# Altium project PowerManagment_V2.PrjPcb
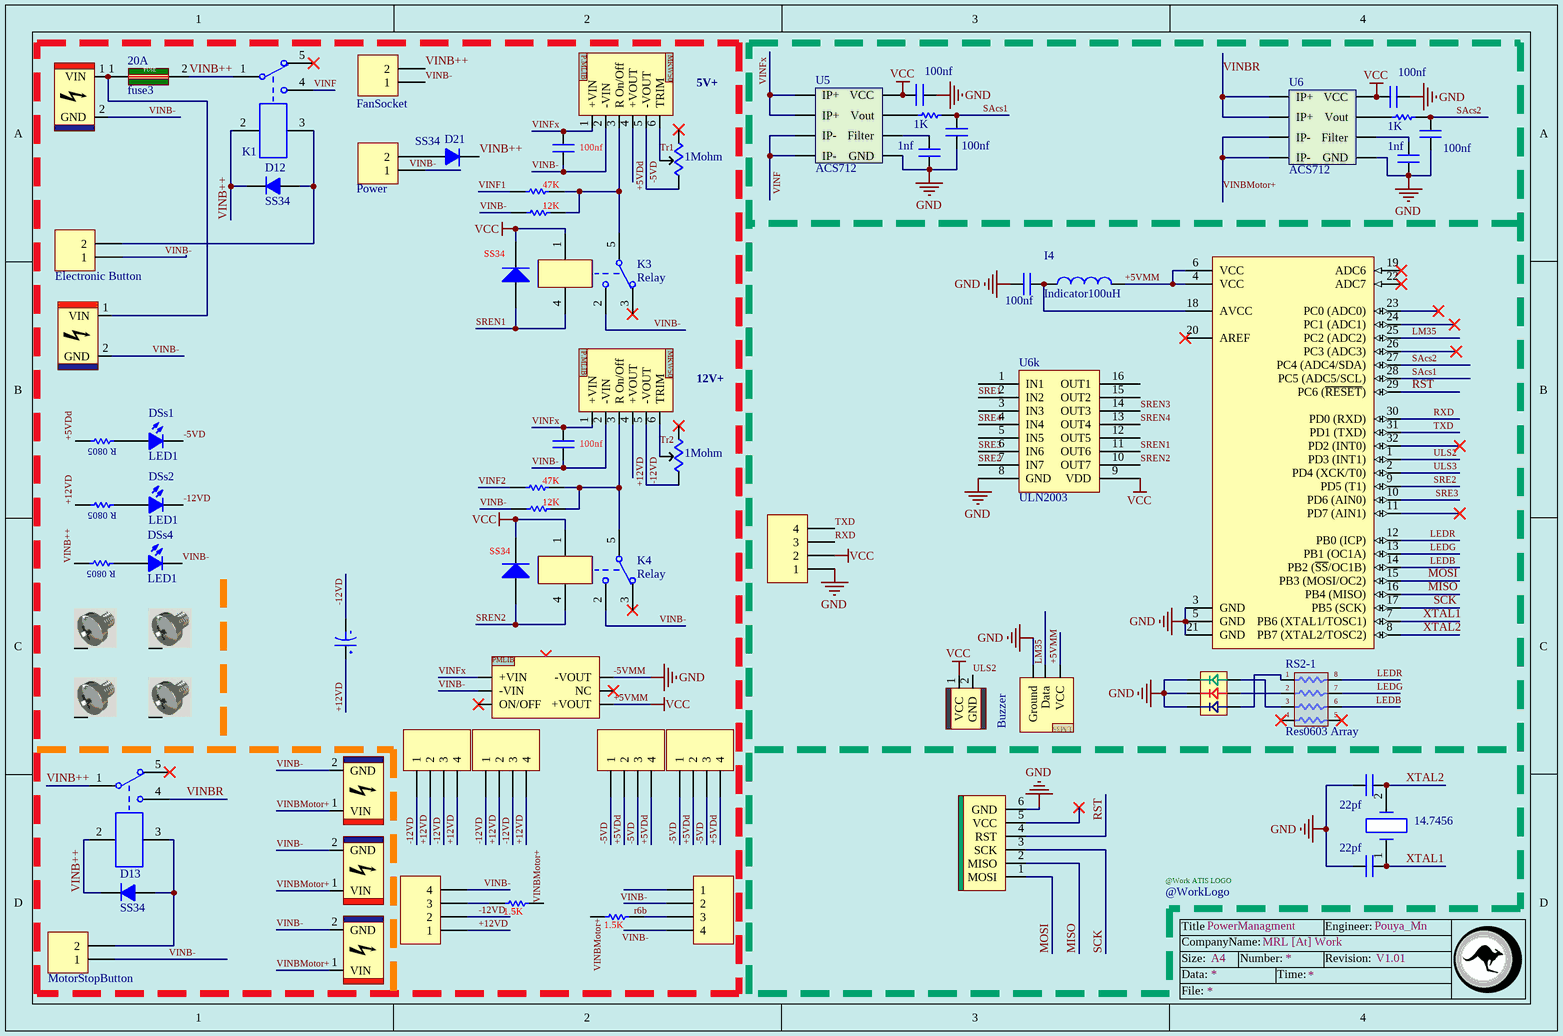
[diagram p0: PowerManagment_V2.SchDoc]
1 sheet, 73 parts. Net scope: global (net labels, ports and power ports of the same name join across sheets).
Board file: PowerManagment_V2.PcbDoc

## Sheet PowerManagment_V2.SchDoc: PowerManagment
size A4; CompanyName: MRL [At] Work; Engineer: Pouya_Mn; Revision: V1.01

### Parts
1SA  Screw  [Screw]  (value not drawn)
2SA  Screw  [Screw]  (value not drawn)
3SA  Screw  [Screw]  (value not drawn)
4SA  Screw  [Screw]  (value not drawn)
20A  fuse3  [fuse 5*20]
ATX1  FanSocket  [ATX_1.2S]
ATX3  MotorStopButton  [ATX_1.2S]
ATX4  Electronic Button  [ATX_1.2S]
ATX6  Power  [ATX_1.2S]
ATXX1  ATX2*2R  [ATX2*2S]  (value not drawn)
ATXX2  ATX2*2R  [ATX2*2S]  (value not drawn)
ATXX6  ATX2*2R  [ATX2*2S]  (value not drawn)
ATXX9  ATX2*2R  [ATX2*2S]  (value not drawn)
B2  Buzzer  [Buzzer]
C2  100nF  [Cap0805]  (value not drawn)
C11  100nf  [Cap0805]
C22  100nF  [Cap0805]  (value not drawn)
C28  22pf  [Cap0805]
C29  22pf  [Cap0805]
CA1  100nf  [Cap0805]
CA2  1nf  [Cap0805]
CA3  1nf  [Cap0805]
CA4  100nf  [Cap0805]
CA6  100nf  [Cap0805]
CA7  100nf  [Cap0805]
Cr3  4.7Uf  [Cap_4mm]  (value not drawn)
D12  SS34  [Diod-1A-SMD]
D13  SS34  [Diod-1A-SMD]
D21  SS34  [Diod-3A-SMD]
DE1  SS34  [Diod-1A-SMD]
DE2  SS34  [Diod-1A-SMD]
DSs1  LED1  [Led0805]
DSs2  LED1  [Led0805]
DSs4  LED1  [Led0805]
f  MINMAXMEW  [MINMAXMEW]  (value not drawn)
I4  Indicator100uH  [1206]
K1  Relay_7  [Relay_7]  (value not drawn)
K3  Relay  [RelayMinionSmall]
K4  Relay  [RelayMinionSmall]
K5  Relay_7  [Relay_7]  (value not drawn)
lm  Lm35  [UGN3503]  (value not drawn)
Logo  @WorkLogo  [@WorkATISLogo]
M1  5V+  [MK50]
M2  12V+  [MK50]
Pro1  Programmer  [Programmer]  (value not drawn)
R46  Res 0805  [R0805]  (value not drawn)
R47  Res 0805  [R0805]  (value not drawn)
R49  Res 0805  [R0805]  (value not drawn)
RA1  1K  [R0805]
RA2-2  1K  [R0805]
RGB  RGBSMD  [LEDRGBSMD]  (value not drawn)
RS1  47K  [R0805]
RS1r  1.5K  [R0805]
RS1rd  1.5K  [R0805]
RS2  12K  [R0805]
RS2-1  Res0603 Array  [Res 0603 Array]
RS3  47K  [R0805]
RS4  12K  [R0805]
Rt1  1Mohm  [Multi_tern]
Rt2  1Mohm  [Multi_tern]
spox1  SPOX1*4  [SPOX_1*4RIGHT]  (value not drawn)
spox2  SPOX1*4  [SPOX_1*4RIGHT]  (value not drawn)
spox12  SPOX1*4  [SPOX_1*4RIGHT]  (value not drawn)
T1  Connector T  [SocketS06]  (value not drawn)
TR1  Connector T  [T_Connector]  (value not drawn)
TR2  Connector T  [T_Connector]  (value not drawn)
TR3  Connector T  [T_Connector]  (value not drawn)
TR5  Connector T  [T_Connector]  (value not drawn)
U4  ATmega8-16AU  [32A_N]  (value not drawn)
U5  ACS712  [SOP8]
U6  ACS712  [SOP8]
U6k  ULN2003  [SO16]
Y  14.7456  [CrystallB]

### Nets
+5VMM: B2.1(VCC) CA1.1 CA4.1 DE1.K DE2.K f.6(+VOUT) I4.2 K3.1 K4.1 lm.1(VCC) spox12.2 U4.4(VCC) U4.6(VCC) U5.8(VCC) U6.8(VCC) U6k.9(VDD)  [also labelled VCC]
-5VMM: C11.1 C28.2 C29.2 CA1.2 CA2.2 CA3.2 CA4.2 CA6.1 CA7.1 f.7(-VOUT) lm.3(Ground) Pro1.6(GND) RGB.1 RGB.2 RGB.3 spox12.1 U4.3(GND) U4.5(GND) U4.21(GND) U5.5(GND) U6.5(GND) U6k.8(GND)  [also labelled GND]
+5VDd: ATXX1.2 ATXX1.4 ATXX6.2 ATXX6.4 M1.4(+VOUT) R47.1
+12VD: ATXX2.2 ATXX2.4 ATXX9.2 ATXX9.4 Cr3.2 M2.4(+VOUT) R46.1 spox1.1
-5VD: ATXX1.1 ATXX1.3 ATXX6.1 ATXX6.3 DSs1.K M1.5(-VOUT) Rt1.1
-12VD: ATXX2.1 ATXX2.3 ATXX9.1 ATXX9.3 Cr3.1 DSs2.K M2.5(-VOUT) Rt2.1 spox1.2
LEDB: RS2-1.6 U4.14(PB2_(~{SS}/OC1B))
LEDG: RS2-1.7 U4.13(PB1_(OC1A))
LEDR: RS2-1.8 U4.12(PB0_(ICP))
LM35: lm.2(Data) U4.25(PC2_(ADC2))
MISO: Pro1.2(MISO) U4.16(PB4_(MISO))
MOSI: Pro1.1(MOSI) U4.15(PB3_(MOSI/OC2))
r6b: spox2.2
RST: Pro1.4(RST) U4.29(PC6_(~{RESET}))
RXD: spox12.3 U4.30(PD0_(RXD))
SAcs1: CA6.2 RA1.1 U4.28(PC5_(ADC5/SCL))
SAcs2: CA7.2 RA2-2.1 U4.27(PC4_(ADC4/SDA))
SCK: Pro1.3(SCK) U4.17(PB5_(SCK))
SRE1: U6k.2(IN2)
SRE2: U4.9(PD5_(T1)) U6k.7(IN7)
SRE3: U4.10(PD6_(AIN0)) U6k.6(IN6)
SRE4: U6k.4(IN4)
SREN1: DE1.A K3.4 U6k.11(OUT6)
SREN2: DE2.A K4.4 U6k.10(OUT7)
SREN3: U6k.14(OUT3)
SREN4: U6k.13(OUT4)
Tr1: M1.6(TRIM) Rt1.2
Tr2: M2.6(TRIM) Rt2.2
TXD: spox12.4 U4.31(PD1_(TXD))
ULS2: B2.2(GND) U4.1(PD3_(INT1))
ULS3: U4.2(PD4_(XCK/T0))
VINB++: 20A.2(OUT) ATX6.2 D12.K D13.K D21.K K1.1 K1.2 K5.1 K5.2 R49.1
VINB-: ATX3.1 ATX4.1 ATX6.1 C2.1 C22.1 DSs4.K f.1(-VIN) K3.2 K4.2 M1.2(-VIN) M2.2(-VIN) RS2.2 RS4.2 spox1.4 spox2.1 spox2.4 T1.2(GND) TR1.2(GND) TR2.2(GND) TR3.2(GND) TR5.2(GND)
VINBMotor+: RS1r.2 RS1rd.2 TR1.1(VIN) TR2.1(VIN) TR3.1(VIN) U6.3(IP-) U6.4(IP-)
VINBR: K5.4 U6.1(IP+) U6.2(IP+)
VINF: K1.4 U5.3(IP-) U5.4(IP-)
VINF1: RS1.2
VINF2: RS3.2
VINFx: C2.2 C22.2 f.2(+VIN) M1.1(+VIN) M2.1(+VIN) U5.1(IP+) U5.2(IP+)
XTAL1: C28.1 U4.7(PB6_(XTAL1/TOSC1)) Y.1
XTAL2: C29.1 U4.8(PB7_(XTAL2/TOSC2)) Y.2
Net20A_1: 20A.1(IN) T1.1(VIN) TR5.1(VIN)
NetATX1_2: ATX1.2 D21.A
NetATX3_2: ATX3.2 D13.A K5.3
NetATX4_2: ATX4.2 D12.A K1.3
NetC11_2: C11.2 I4.1 U4.18(AVCC)
NetCA2_1: CA2.1 U6.6(Filter)
NetCA3_1: CA3.1 U5.6(Filter)
NetDSs1_A: DSs1.A R47.2
NetDSs2_A: DSs2.A R46.2
NetDSs4_A: DSs4.A R49.2
NetK3_5: K3.5 M1.3(R_On/Off) RS1.1 RS2.1
NetK4_5: K4.5 M2.3(R_On/Off) RS3.1 RS4.1
NetRA1_2: RA1.2 U5.7(Vout)
NetRA2-2_2: RA2-2.2 U6.7(Vout)
NetRGB_4: RGB.4 RS2-1.1
NetRGB_5: RGB.5 RS2-1.2
NetRGB_6: RGB.6 RS2-1.3
NetRS1r_1: RS1r.1 spox1.3
NetRS1rd_1: RS1rd.1 spox2.3

Not connected (* = marked no-connect by the designer): 1SA S; 2SA S; 3SA S; 4SA S; ATX1 1; f 3(ON/OFF)* 5(NC)* 8(NC)*; K1 5*; K3 3*; K4 3*; K5 5*; Pro1 5(VCC)*; RS2-1 4* 5*; Rt1 3*; Rt2 3*; U4 11(PD7_(AIN1))* 19(ADC6)* 20(AREF)* 22(ADC7)* 23(PC0_(ADC0))* 24(PC1_(ADC1))* 26(PC3_(ADC3))* 32(PD2_(INT0))*; U6k 1(IN1) 3(IN3) 5(IN5) 12(OUT5) 15(OUT2) 16(OUT1)

### Notes on the sheet
- (near C2) 100nf
- (near C22) 100nf
- Labels drawn without touching a wire or pin: VINB-
- Title
- Size:
- Data:
- CompanyName:
- A4
- Number:
- Time:
- Revision:
- Engineer:
- File:
- (in symbol @WorkLogo) @Work ATIS LOGO
- (in symbol fuse3) FUSE
- (in symbol Lm35) LM35
- (in symbol MINMAXMEW) PMLIB
- (in symbol MK50_DCTODC) P.MLIB; MKW50
- (in symbol Res 0805) R 0805

### Library data of the parts
ATX1 ATX3 ATX4 ATX6 = ATX_1.2R
C2 C11 C22 C28 C29 CA1-CA4 CA6 CA7 = Cap0805: surface mount capacitor (size 805)
Cr3 = Cap_Pola
D12 D13 D21 DE1 DE2 = Diode
K3 K4 = RelayMilon
M1 M2 = MK50_DCTODC
RA1 RA2-2 RS1 RS1r RS1rd RS2-RS4 = Res 0805
Rt1 Rt2 = POT1
U4 = ATmega8-16AU: 8-bit AVR Microcontroller, 4.5-5.5V, 16MHz, 8KB Flash, 512 Bytes EEPROM, 1KB SRAM, 32-pin TQFP, Industrial Grade (-40°C to 85°C); DatasheetVersion: revZ, Feb-2011; PackageVersion: revC, Oct-2010; PackageReference: 32A; PackageDescription: 32-Lead, 7x7x1.0 mm Body, 0.8mm Lead Pitch, Thin Profile Plastic Quad Flat Package (TQFP); Code_JEDEC: MS-026-ABA; ComponentLink1Description: Manufacturer URL; ComponentLink1URL: http://www.atmel.com/; ComponentLink2Description: ATmega8(L); ComponentLink2URL: http://www.atmel.com/dyn/resources/prod_documents/doc2486.pdf; ComponentLink3Description: ATmega8(L) Summary; ComponentLink3URL: http://www.atmel.com/dyn/resources/prod_documents/2486S.pdf
U5 U6 = ACS712: Hall effect Current Sensor
Y = Xtal 1